# EAGLE design LNetPanel (EAGLE 7.7.0)
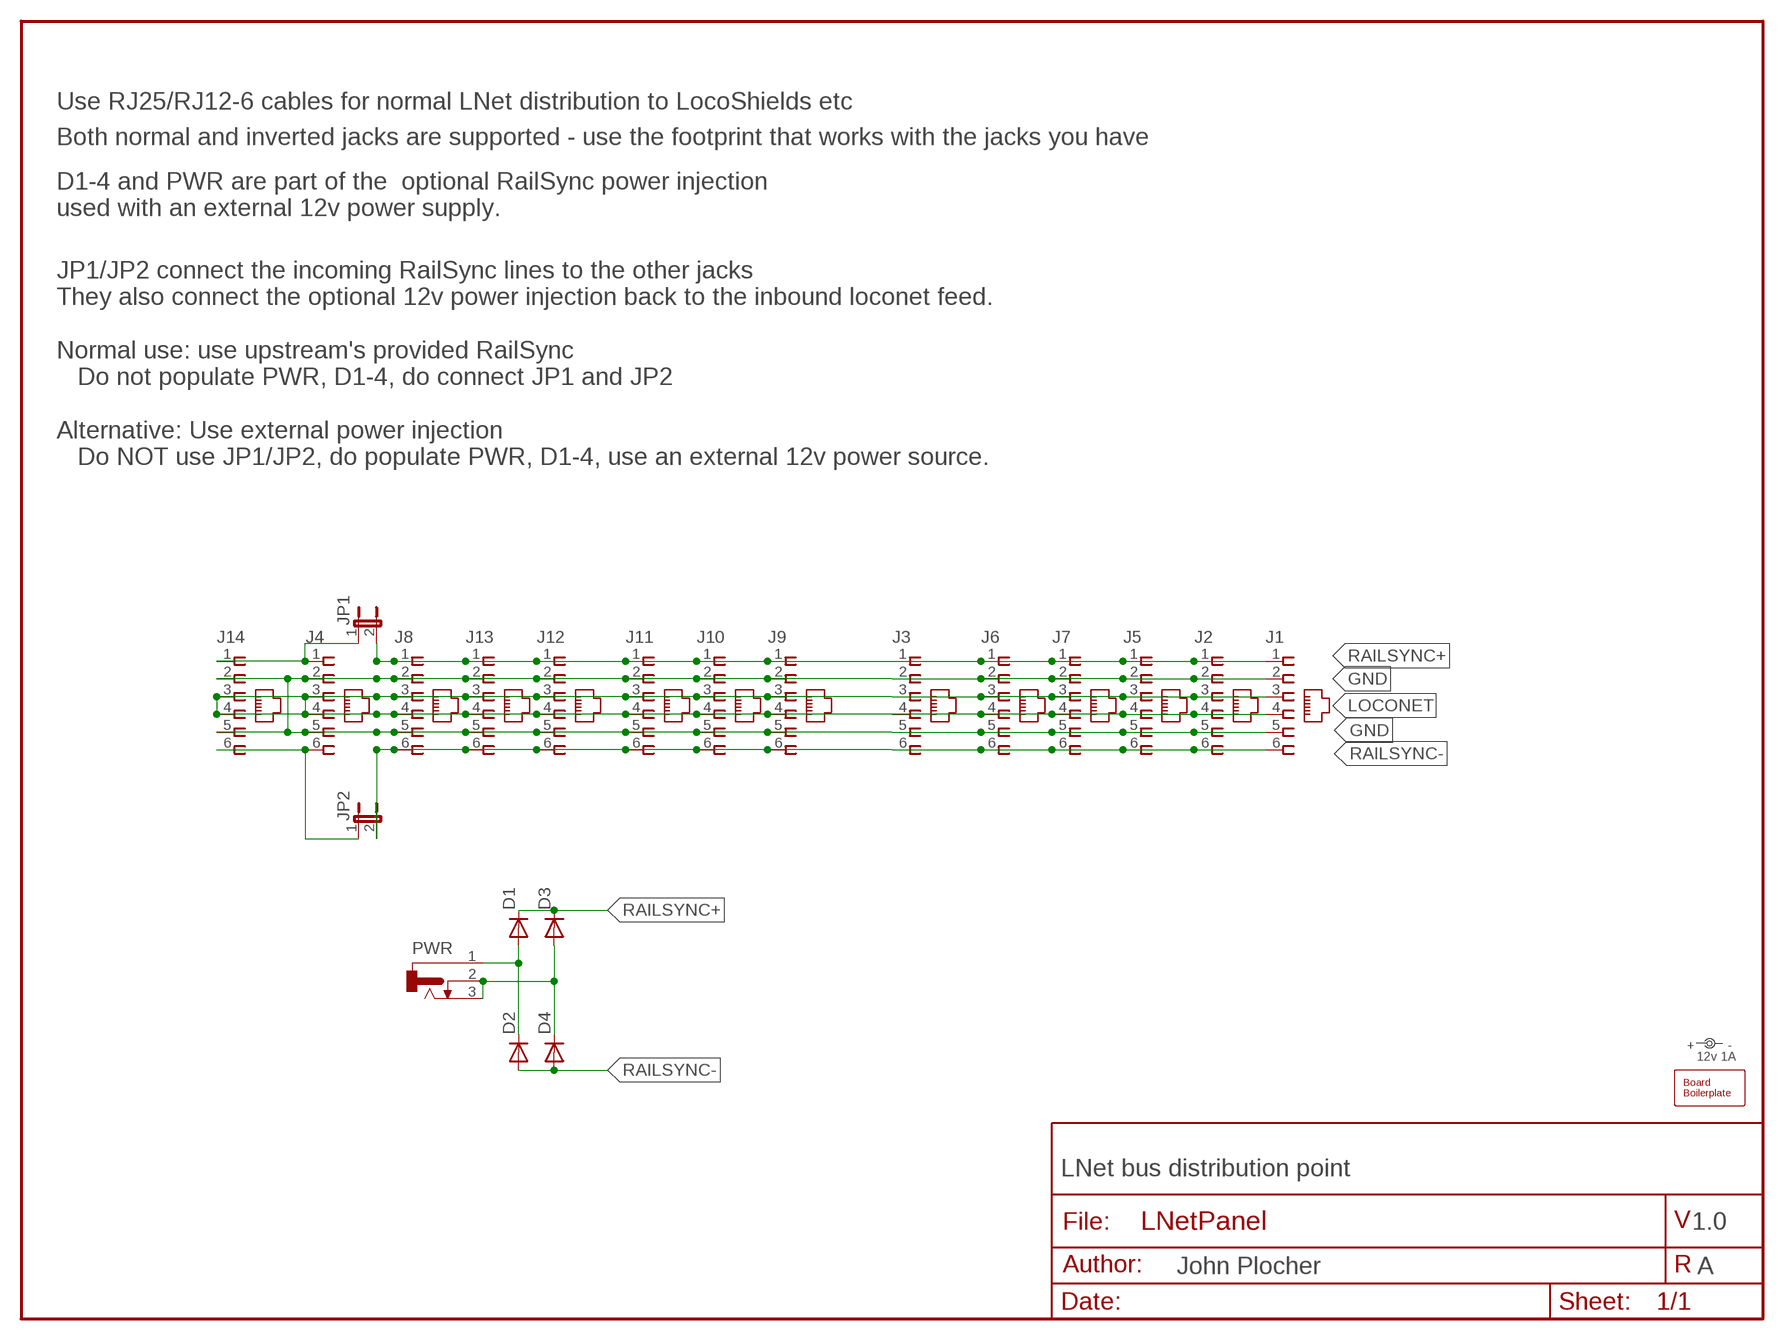
[diagram p0: schematic, sheet 1]

## Parts
D1  DIODEPTH  [DIODE-1N4001]
D2  DIODEPTH  [DIODE-1N4001]
D3  DIODEPTH  [DIODE-1N4001]
D4  DIODEPTH  [DIODE-1N4001]
J1  CONNECTOR-RJ25-43860-2-MOLEX  [RJ25-INVERTED]
J2  CONNECTOR-RJ25-43860-2-MOLEX  [RJ25-INVERTED]
J3  CONNECTOR-RJ25-43860-2-MOLEX  [RJ25-INVERTED]
J4  CONNECTOR-RJ25-43860-2-MOLEX  [RJ25-INVERTED]
J5  CONNECTOR-RJ25-43860-2-MOLEX  [RJ25-INVERTED]
J6  CONNECTOR-RJ25-43860-2-MOLEX  [RJ25-INVERTED]
J7  CONNECTOR-RJ25-43860-2-MOLEX  [RJ25-INVERTED]
J8  CONNECTOR-RJ25AMP  [RJ25-PANEL]
J9  CONNECTOR-RJ25AMP  [RJ25-PANEL]
J10  CONNECTOR-RJ25AMP  [RJ25-PANEL]
J11  CONNECTOR-RJ25AMP  [RJ25-PANEL]
J12  CONNECTOR-RJ25AMP  [RJ25-PANEL]
J13  CONNECTOR-RJ25AMP  [RJ25-PANEL]
J14  CONNECTOR-RJ25AMP  [RJ25-PANEL]
JP1  JUMPER-2PTH_LOCK  [1X02_LOCK]
JP2  JUMPER-2PTH_LOCK  [1X02_LOCK]
PWR  CONNECTOR-DC-POWER-RA  [DCJ0202]
U$1  BOARD50X50-HOHOLES  BOARD70X70  [BOARD-SEEED7X7]
U$2  12v 1A  DOC-POWER_LABEL  [POWER_USAGE]

## Nets
GND: J1.2 J1.5 J2.2 J2.5 J3.2 J3.5 J4.2 J4.5 J5.2 J5.5 J6.2 J6.5 J7.2 J7.5 J8.2 J8.5 J9.2 J9.5 J10.2 J10.5 J11.2 J11.5 J12.2 J12.5 J13.2 J13.5 J14.2 J14.5
LOCONET: J1.3 J1.4 J2.3 J2.4 J3.3 J3.4 J4.3 J4.4 J5.3 J5.4 J6.3 J6.4 J7.3 J7.4 J8.3 J8.4 J9.3 J9.4 J10.3 J10.4 J11.3 J11.4 J12.3 J12.4 J13.3 J13.4 J14.3 J14.4
N$1 [power]: D3.A D4.C PWR.2 PWR.3
N$2 [power]: D1.A D2.C PWR.1
N$3: J4.1 J14.1 JP1.1
N$4: J4.6 J14.6 JP2.1
RAILSYNC+ [power]: D1.C D3.C J1.1 J2.1 J3.1 J5.1 J6.1 J7.1 J8.1 J9.1 J10.1 J11.1 J12.1 J13.1 JP1.2
RAILSYNC- [power]: D2.A D4.A J1.6 J2.6 J3.6 J5.6 J6.6 J7.6 J8.6 J9.6 J10.6 J11.6 J12.6 J13.6 JP2.2

## Notes on the sheet
- Use RJ25/RJ12-6 cables for normal LNet distribution to LocoShields etc
- Both normal and inverted jacks are supported - use the footprint that works with the jacks you have
- D1-4 and PWR are part of the  optional RailSync power injection
  used with an external 12v power supply.
- JP1/JP2 connect the incoming RailSync lines to the other jacks
  They also connect the optional 12v power injection back to the inbound loconet feed.
  
  Normal use: use upstream's provided RailSync
     Do not populate PWR, D1-4, do connect JP1 and JP2
  
  Alternative: Use external power injection
     Do NOT use JP1/JP2, do populate PWR, D1-4, use an external 12v power source.
- LNet bus distribution point
- 1.0
- A

## Library data of the parts
D1-D4 = SPCoast:DIODE: Diode These are standard reverse protection diodes and small signal diodes. SMA package can handle up to about 1A. SOD-323 can handle about 200mA. What the SOD-323 package when ordering, there are some mfgs out there that are 5-pin packages.
J1-J7 = SPCoast:CONNECTOR-RJ25: AMP connector
J8-J14 = SPCoast:CONNECTOR-RJ25: AMP connector; AMP: 520250-3; OPL: none
JP1 JP2 = SPCoast:JUMPER-2: Jumper Basic 0.1" spaced jumper. Use with breakaway headers.
PWR = SPCoast:CONNECTOR-DC-POWER: DC POWER JACK Source: DCJ0202.pdf
U$1 = SPCoast:BOARD
U$2 = SPCoast:DOC-POWER_LABEL

## Net classes
0 default: width 0.305 mm, drill 0.508 mm, clearance 0.254 mm
1 power: width 0.61 mm, drill 0.8 mm, clearance 0.254 mm

## Board
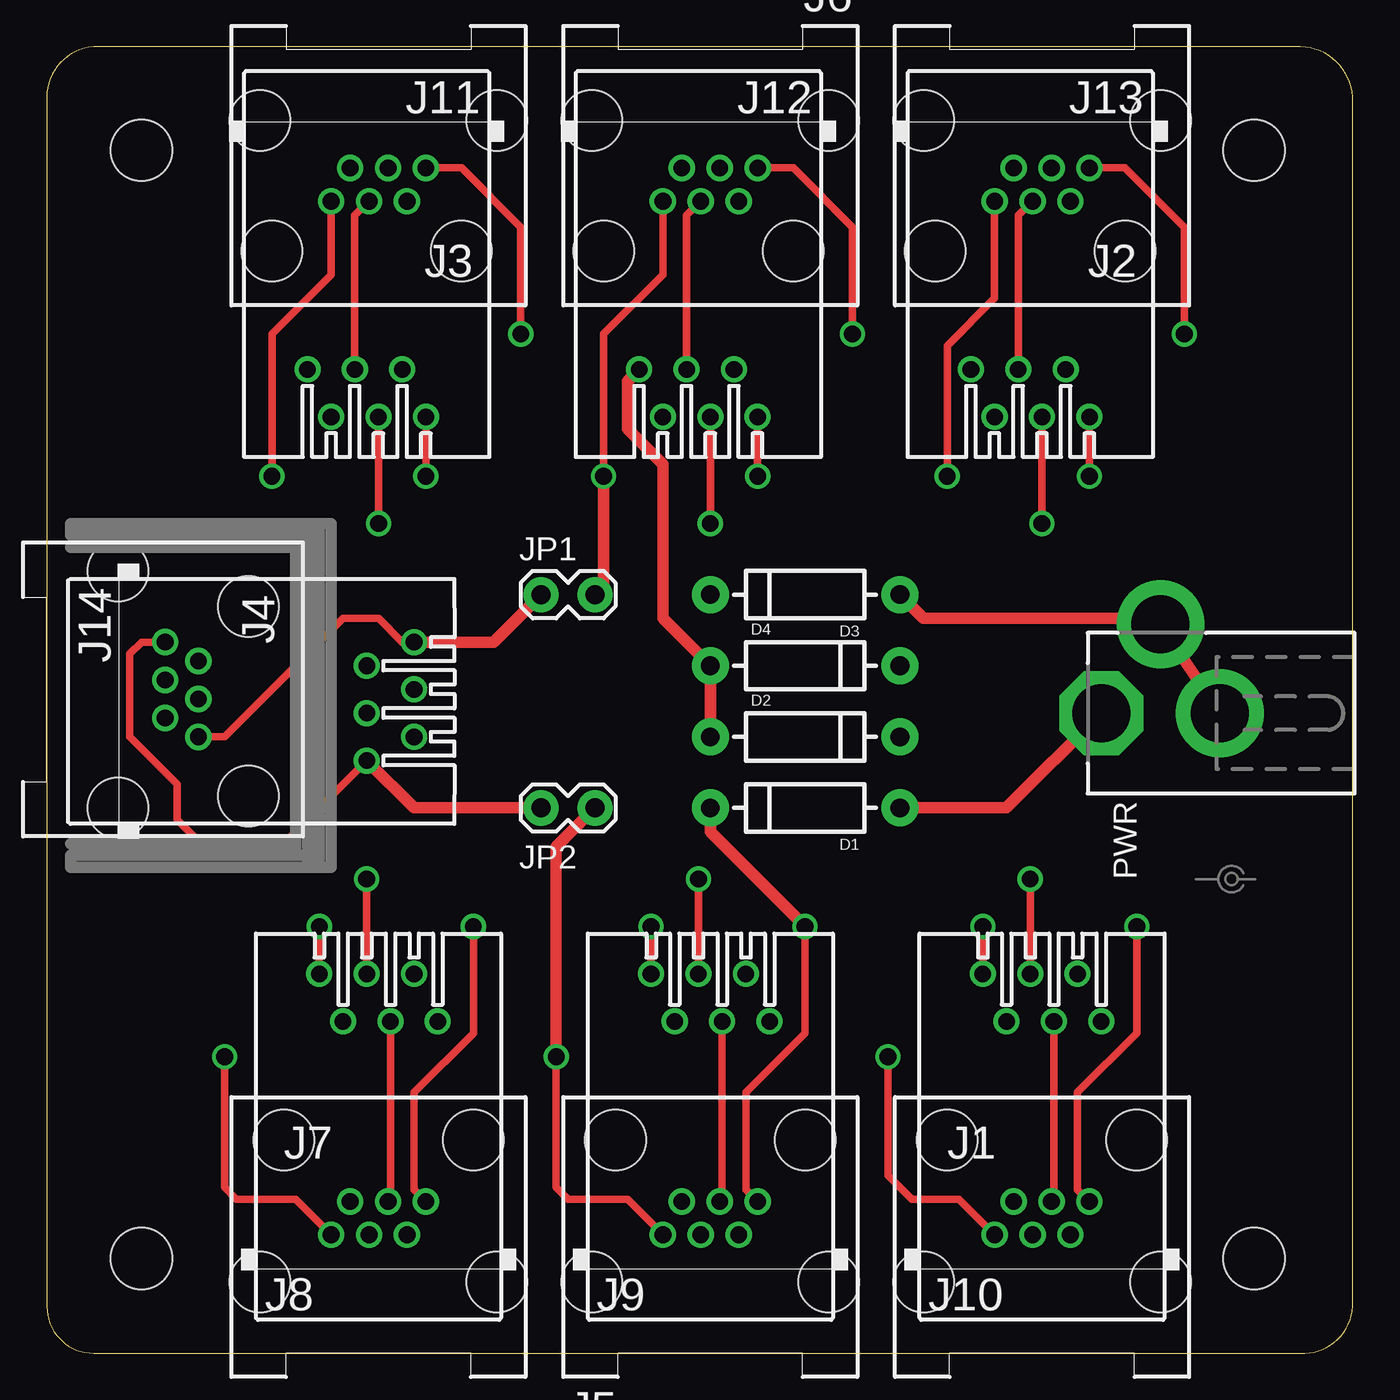
[diagram p1: board, top side]
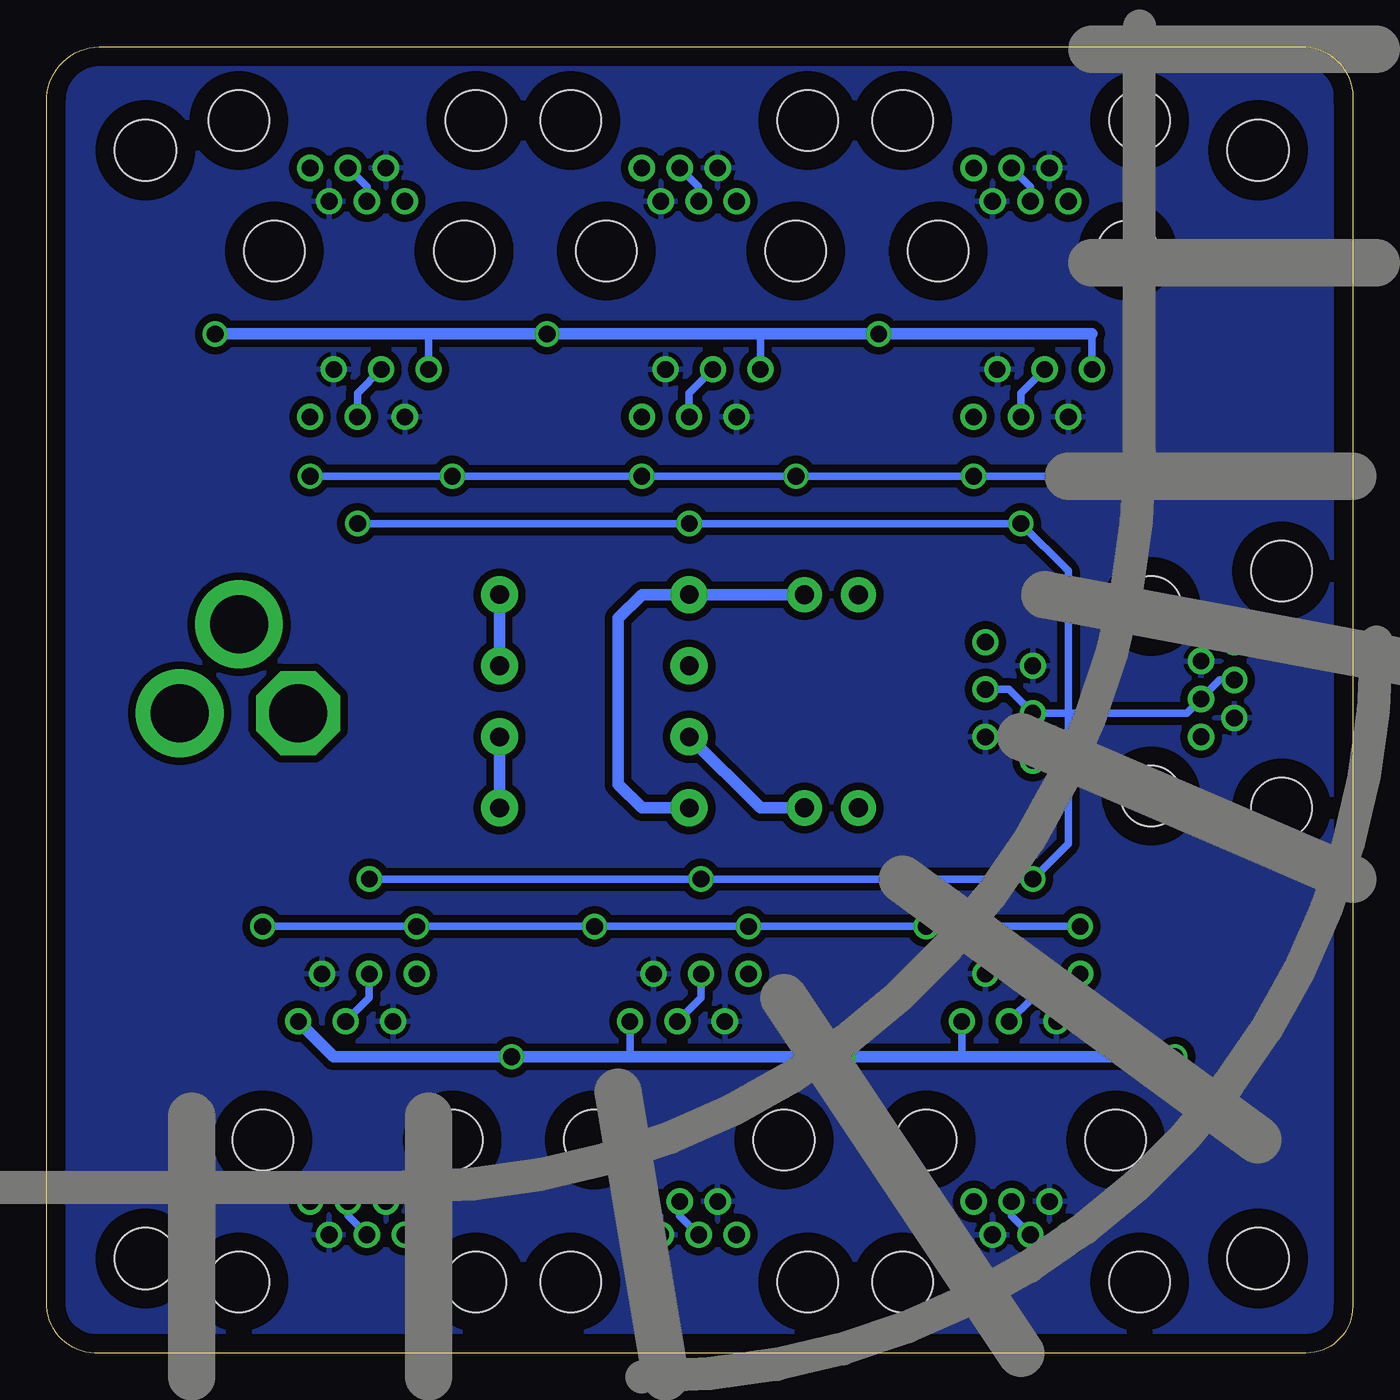
[diagram p2: board, bottom side, seen from below]

Size 70.01 x 70 mm. Coordinates in mm from the lower left corner, seen from the top.
Copper layers (1*16): Top 0.035mm / dielectric 1.5mm / Bottom 0.035mm
Design rules "default": minimum track width 10mil, minimum drill 0.6mm, track to track 8mil, track to pad 8mil, pad to pad 8mil, via to via 8mil, smd to smd 8mil, copper to edge 40mil, drill to drill 8mil, minimum pad ring 10mil, minimum via ring 8mil, stop-mask expansion 4mil, vias tented up to drill 0mil, thermal gap 10mil

### Footprints (pad centres in the part's own frame; a part is rotated, then mirrored left to right if it is on the bottom)
DIODE-1N4001 = drill 1 pad 1.981: A -5.08,0; C 5.08,0
RJ25-INVERTED = drill 0.9 pad 1.4: 1 2.54,4.318; 2 1.524,2.54; 3 0.508,4.318; 4 -0.508,2.54; 5 -1.524,4.318; 6 -2.54,2.54 | hole 3.251: -6.35,0; 6.35,0
RJ25-PANEL = drill 0.889: 1 -3.175,8.89; 2 -1.905,6.35; 3 -0.635,8.89; 4 0.635,6.35; 5 1.905,8.89; 6 3.175,6.35 | hole 3.251: -5.08,0; 5.08,0
1X02_LOCK = drill 1.016 pad 1.88: 1 -0.178,0; 2 2.718,0
DCJ0202 = drill 3.1 pad 4.5 octagon: 1 0,3.175 | drill 3.1 pad 4.7: 2 4.763,0; 3 0,-3.175
BOARD-SEEED7X7 = hole 3.3: 64.704,5.08; 5.08,64.45; 64.704,64.45; 5.08,5.08

### Placement (x,y rotation side)
D1  40.65,29.21 180 top
D2  40.65,33.02 0 top
D3  40.65,40.64 180 top
D4  40.65,36.83 0 top
J1  53.35,3.81 0 top
J2  53.35,66.04 180 top
J3  17.79,66.04 180 top
J4  3.82,35.56 270 top
J5  35.57,3.81 0 top
J6  35.57,66.04 180 top
J7  17.79,3.81 0 top
J8  17.79,11.43 0 top
J9  35.57,11.43 0 top
J10  53.35,11.43 0 top
J11  17.15,59.06 180 top
J12  34.93,59.06 180 top
J13  52.71,59.06 180 top
J14  10.8,34.93 270 top
JP1  26.68,40.64 0 top
JP2  26.68,29.21 0 top
PWR  59.7,34.29 90 top
U$1  0.01,0 0 top
U$2  63.51,25.4 270 top

### Tracks (layer width: path | path; a pad name or v marks a point on that pad's centre or on a via)
GND
  pour Bottom (isolate 0.406): 0.01,71.12 71.13,71.12 71.13,0 0.01,0
LOCONET  (via drill 0.9)
  Top 0.406: J3.3 16.52,60.96 J11.4 | J6.3 34.3,60.96 J12.4 | J2.3 52.08,60.96 J13.4 | J7.3 18.42,8.26 J8.4 | J5.3 36.2,8.26 J9.4 | J1.3 53.98,8.26 J10.4 | v17.79,44.45 J11.3 | v35.57,44.45 J12.3 | v53.35,44.45 J13.3 | J8.3 v17.15,25.4 | v34.93,25.4 J9.3 | v52.71,25.4 J10.3
  Bottom 0.406: J3.4 17.28,62.49 J3.3 | J6.4 35.06,62.49 J6.3 | J2.4 52.84,62.49 J2.3 | J1.4 53.86,7.37 J1.3 | J5.4 36.08,7.37 J5.3 | J7.4 18.3,7.37 J7.3 | v53.35,44.45 v35.57,44.45 v17.79,44.45 15.25,41.91 15.25,34.29 | v52.71,25.4 v34.93,25.4 v17.15,25.4 15.25,27.31 15.25,34.29 | J4.4 7.12,36.07 J4.3 8.9,34.29 15.25,34.29 | J11.4 17.79,51.44 J11.3 | J12.4 35.57,51.44 J12.3 | J13.4 53.35,51.44 J13.3 | J8.4 17.15,19.05 J8.3 | J9.4 34.93,19.05 J9.3 | J10.4 52.71,19.05 J10.3 | J14.3 18.42,35.56 J14.4 15.25,34.29
N$1
  Top 0.61: D3.A 47,39.37 59.38,39.37 PWR.2 PWR.3
  Bottom 0.61: D3.A D4.C
N$2
  Top 0.61: PWR.1 51.44,29.21 D1.A
  Bottom 0.61: D2.C D1.A
N$3
  Top 0.406: J14.1 19.06,38.1 17.79,39.37 15.88,39.37 9.53,33.02 J4.1
  Top 0.61: JP1.1 23.96,38.1 J14.1
N$4
  Top 0.406: J4.6 5.09,38.1 4.45,37.47 4.45,33.02 6.99,30.48 6.99,28.58 8.9,26.67 12.07,26.67 J14.6
  Top 0.61: JP2.1 19.69,29.21 J14.6
RAILSYNC+  (via drill 0.9)
  Top 0.406: J6.1 33.03,57.79 29.85,54.61 v29.85,46.99 | J3.1 15.25,57.79 12.07,54.61 v12.07,46.99 | J2.1 50.81,56.52 48.27,53.98 v48.27,46.99 | v55.89,46.99 J13.1 | J8.1 v14.61,22.86 | v32.39,22.86 J9.1 | v50.17,22.86 J10.1 | J7.1 19.69,8.77 19.69,13.97 22.87,17.15 v22.87,22.86 | J5.1 37.47,8.77 37.47,13.97 40.65,17.15 v40.65,22.86 | J1.1 55.25,8.77 55.25,13.97 58.43,17.15 v58.43,22.86 | J12.1 v38.11,46.99 | J11.1 v20.33,46.99
  Top 0.61: v29.85,46.99 29.85,41.1 JP1.2 | v40.65,22.86 35.57,27.94 D1.C
  Bottom 0.406: v14.61,22.86 v22.87,22.86 v32.39,22.86 v40.65,22.86 v50.17,22.86 v58.43,22.86 | v12.07,46.99 v20.33,46.99 v29.85,46.99 v38.11,46.99 v48.27,46.99 v55.89,46.99
  Bottom 0.61: D1.C 38.11,29.21 39.38,30.48 39.38,39.37 38.11,40.64 D3.C JP1.2
RAILSYNC-  (via drill 0.9)
  Top 0.406: J2.6 57.79,63.5 60.97,60.33 v60.97,54.61 | J6.6 40.01,63.5 43.19,60.33 v43.19,54.61 | J3.6 22.23,63.5 25.41,60.33 v25.41,54.61 | J7.6 13.34,8.26 10.17,8.26 9.53,8.89 v9.53,15.88 | J5.6 31.12,8.26 27.95,8.26 27.31,8.89 v27.31,15.88 | J1.6 48.9,8.26 46.36,8.26 45.09,9.53 v45.09,15.88
  Top 0.61: D2.A D4.A 33.03,39.37 33.03,47.63 31.12,49.53 31.12,52.07 J12.6 | v27.31,15.88 27.31,27.13 JP2.2
  Bottom 0.406: 13.98,54.61 J11.6 | J12.6 31.76,54.61 | J13.6 49.54,54.61 | J8.6 20.96,15.88 | J9.6 38.74,15.88
  Bottom 0.61: v9.53,15.88 20.96,15.88 v27.31,15.88 38.74,15.88 v45.09,15.88 54.62,15.88 J10.6 | v60.97,54.61 49.54,54.61 v43.19,54.61 31.76,54.61 v25.41,54.61 13.98,54.61 | D2.A 31.76,29.21 JP2.2

### Text on the board
tDocu: LNet Panel | OSHW | v1.1A | 2016.11 | John Plocher | RailSync / Isolation
bDocu: Made in the PCR, Coast Division, NMRA | Go Bears! | LNet / Distribution / Panel | www.SPCoast.com | Model / Railroading / is fun!
Changes: Added jimpers instead of switch